# EAGLE design circuit (EAGLE 7.2.0)
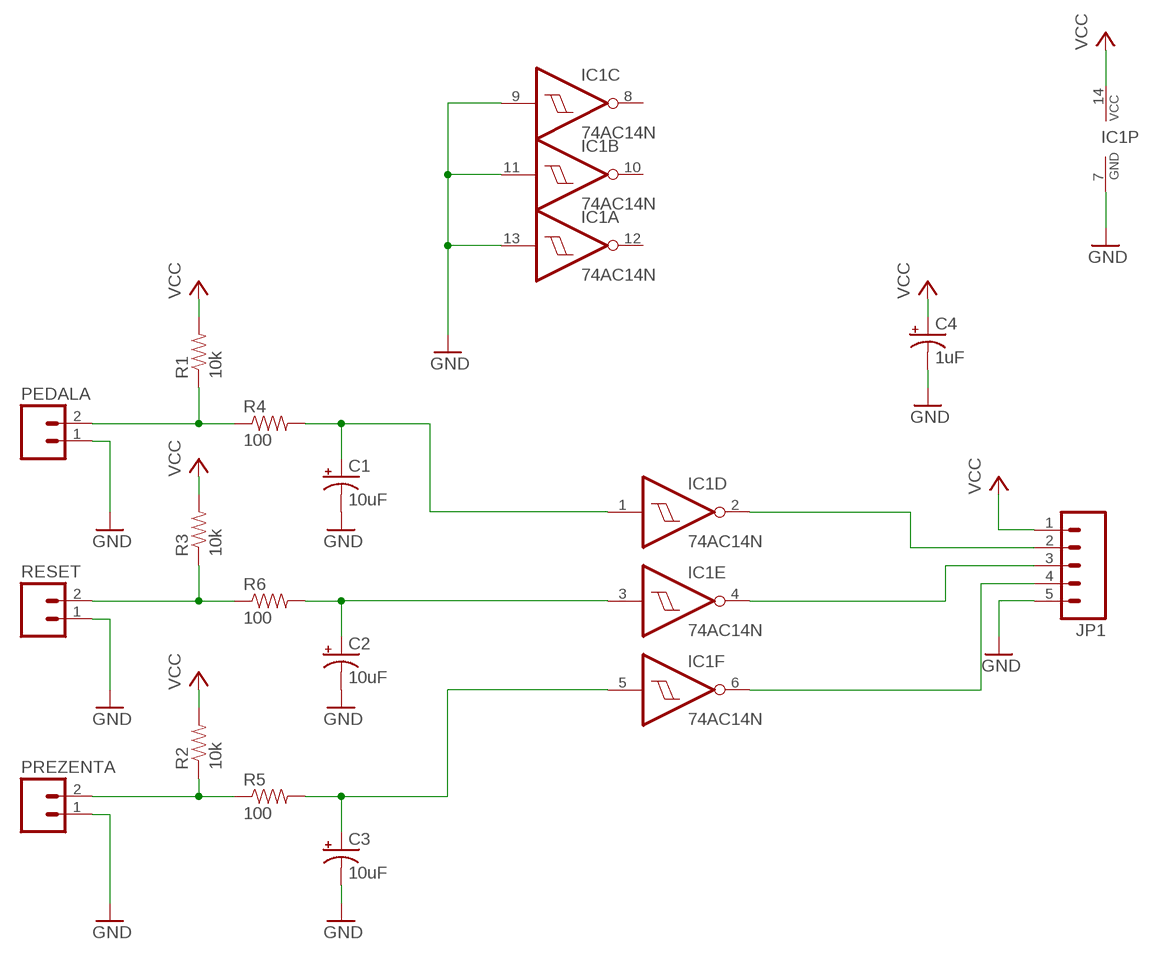
[diagram p0: schematic, sheet 1]

## Parts
C1  10uF  CAP_POLPTH2  [CPOL-RADIAL-10UF-25V]
C2  10uF  CAP_POLPTH2  [CPOL-RADIAL-10UF-25V]
C3  10uF  CAP_POLPTH2  [CPOL-RADIAL-10UF-25V]
C4  1uF  CAP_POLPTH2  [CPOL-RADIAL-10UF-25V]
IC1  74AC14N  [DIL14]
JP1  M05PTH_LONGPADS  [1X05_LONGPADS]
PEDALA  M025MM  [SCREWTERMINAL-5MM-2]
PREZENTA  M025MM  [SCREWTERMINAL-5MM-2]
R1  10k  RESISTORPTH-1/4W  [AXIAL-0.4]
R2  10k  RESISTORPTH-1/4W  [AXIAL-0.4]
R3  10k  RESISTORPTH-1/4W  [AXIAL-0.4]
R4  100  RESISTORPTH-1/4W  [AXIAL-0.4]
R5  100  RESISTORPTH-1/4W  [AXIAL-0.4]
R6  100  RESISTORPTH-1/4W  [AXIAL-0.4]
RESET  M025MM  [SCREWTERMINAL-5MM-2]

## Nets
GND: C1.2(-) C2.2(-) C3.2(-) C4.2(-) IC1.7(P:GND) IC1.9(C:I) IC1.11(B:I) IC1.13(A:I) JP1.5 PEDALA.1 PREZENTA.1 RESET.1
N$1: PEDALA.2 R1.P$1 R4.P$1
N$2: C1.1(+) IC1.1(D:I) R4.P$2
N$3: R3.P$1 R6.P$1 RESET.2
N$4: C2.1(+) IC1.3(E:I) R6.P$2
N$5: PREZENTA.2 R2.P$1 R5.P$1
N$6: C3.1(+) IC1.5(F:I) R5.P$2
N$7: IC1.2(D:O) JP1.2
N$8: IC1.4(E:O) JP1.3
N$9: IC1.6(F:O) JP1.4
VCC: C4.1(+) IC1.14(P:VCC) JP1.1 R1.P$2 R2.P$2 R3.P$2
Unconnected: IC1.8(C:O) IC1.10(B:O) IC1.12(A:O)

## Library data of the parts
C1-C4 = SparkFun-Passives:CAP_POL: Capacitor Polarized These are standard SMD and PTH capacitors. Normally 10uF, 47uF, and 100uF in electrolytic and tantalum varieties. Always verify the external diameter of the through hole cap, it varies with capacity, voltage, and manufacturer. The EIA devices should be standard.
IC1 = 74xx-eu:74*14: Hex schmitt trigger INVERTER
JP1 = SparkFun-Connectors:M05: Header 5 Standard 5-pin 0.1" header. Use with straight break away headers (SKU : PRT-00116), right angle break away headers (PRT-00553), swiss pins (PRT-00743), machine pins (PRT-00117), and female headers (PRT-00115). Molex polarized connector foot print use with SKU : PRT-08230 with associated crimp pins and housings.
PEDALA PREZENTA RESET = SparkFun-Connectors:M02: Standard 2-pin 0.1" header. Use with - straight break away headers ( PRT-00116) - right angle break away headers (PRT-00553) - swiss pins (PRT-00743) - machine pins (PRT-00117) - female headers (PRT-00115) Molex polarized connector foot print use with: PRT-08233 with associated crimp pins and housings. 2.54_SCREWTERM for use with PRT-10571. 3.5mm Screw Terminal footprints for PRT-08084 5mm Screw Terminal footprints for use with PRT-08432; STOREFRONT_ID: PRT-08432
R1-R6 = SparkFun-Resistors:RESISTOR: Resistor Basic schematic elements and footprints for 0603, 1206, and PTH resistors.

## Board
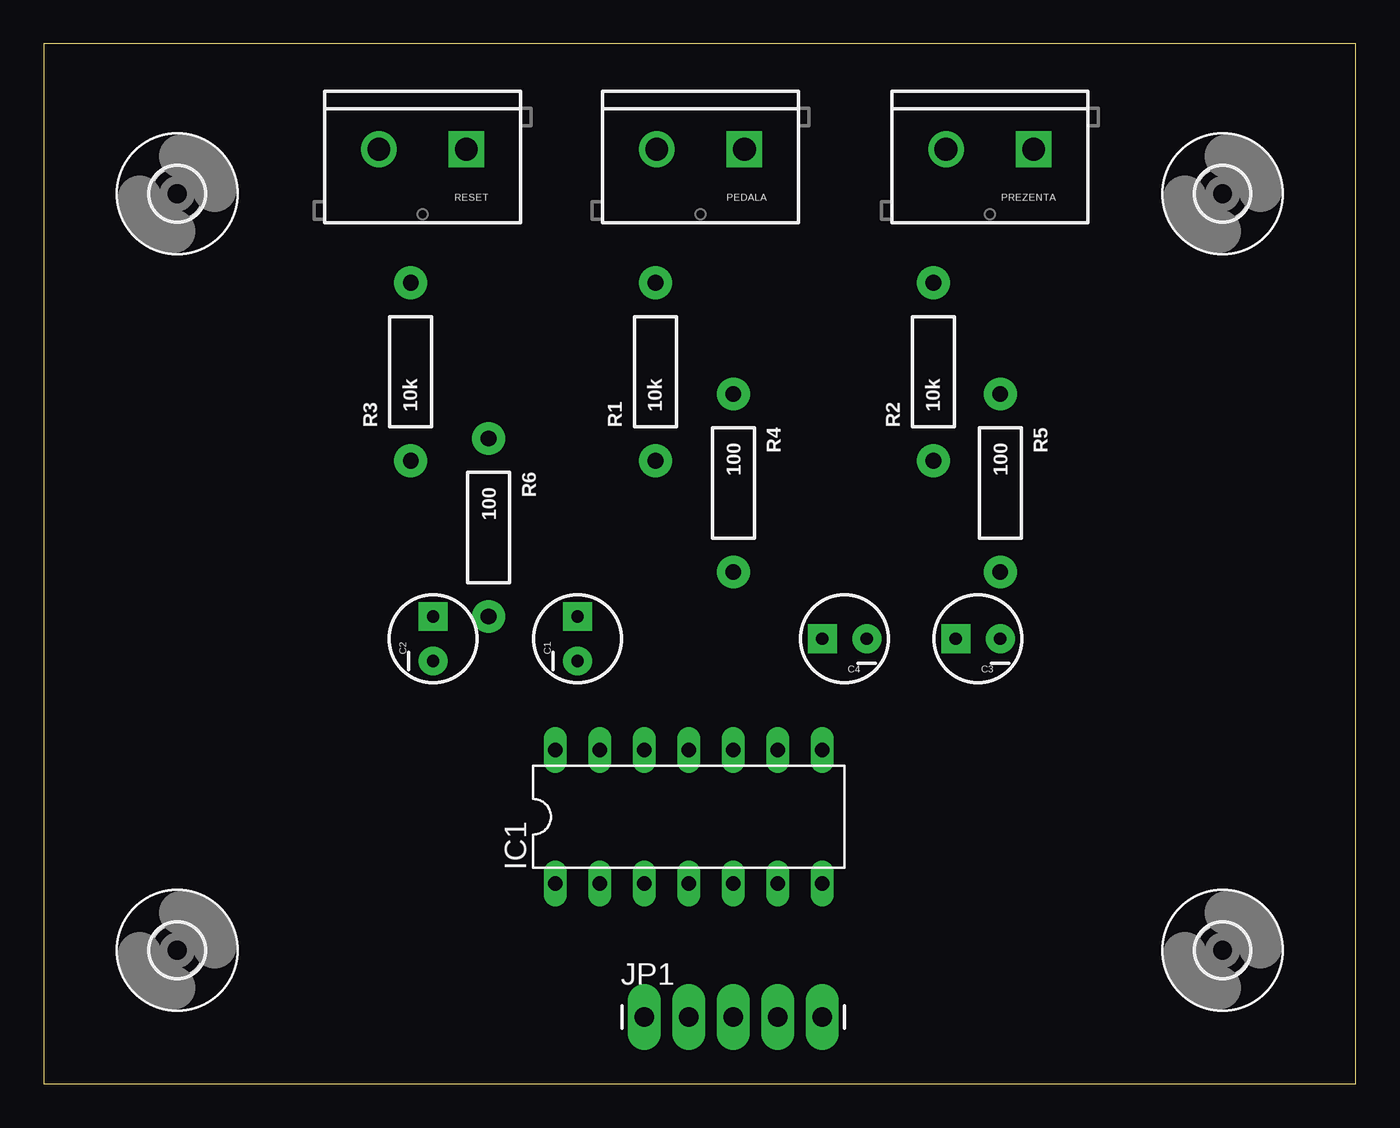
[diagram p1: board, top side]
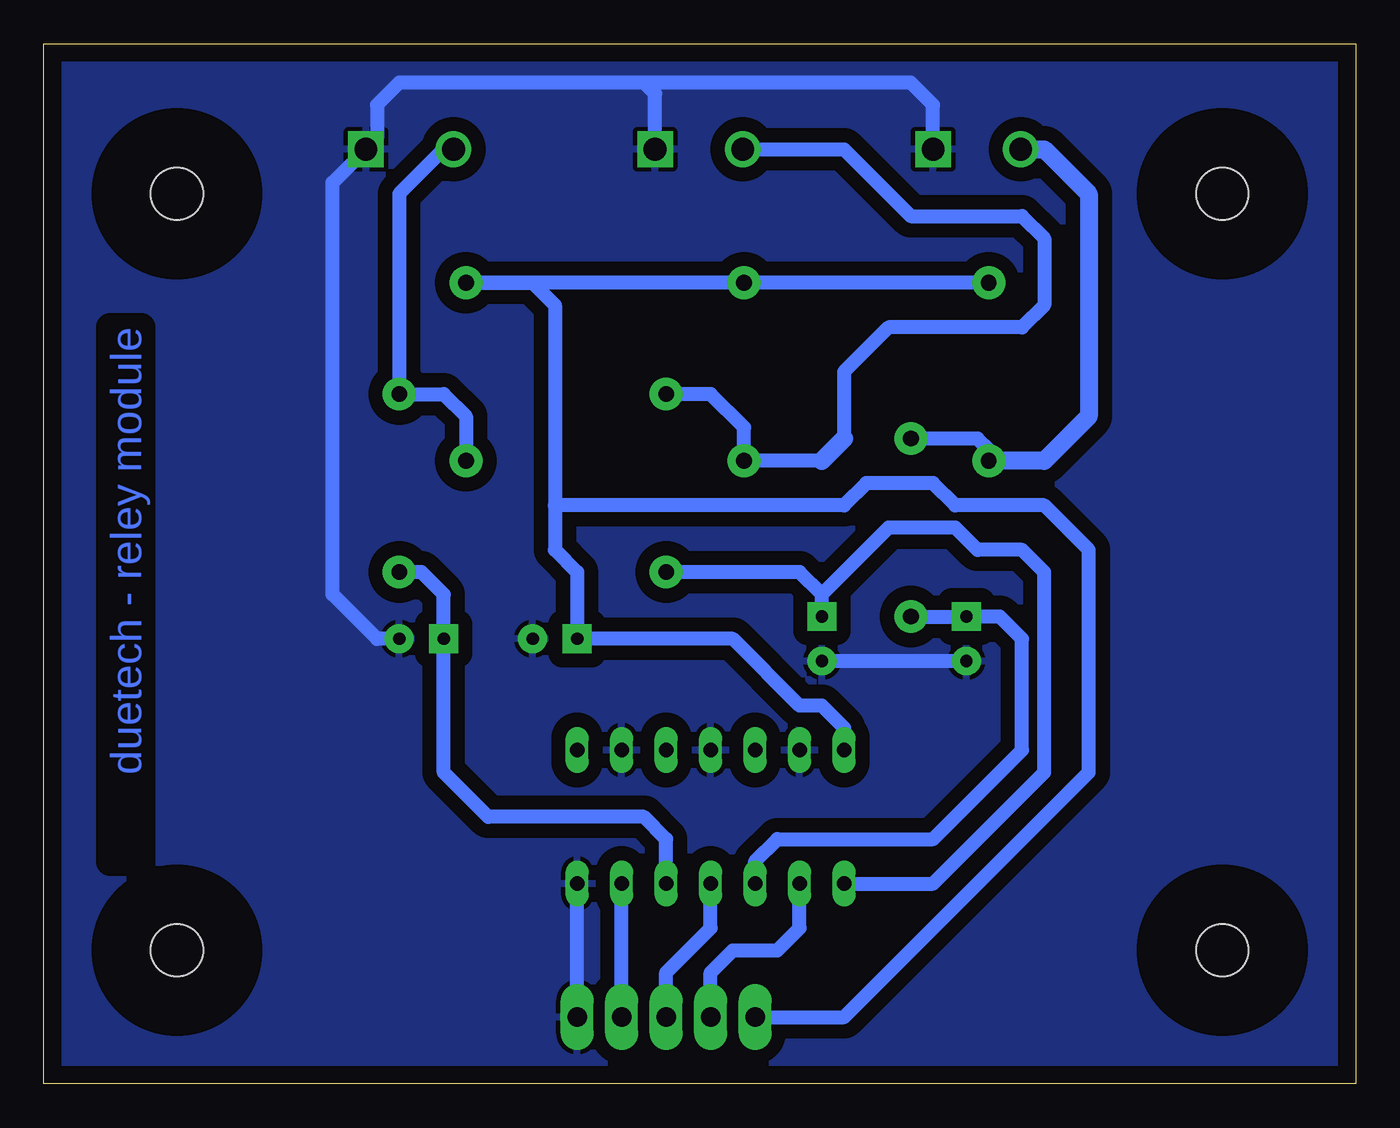
[diagram p2: board, bottom side, seen from below]

Size 74.91 x 59.36 mm. Coordinates in mm from the lower left corner, seen from the top.
Outline: 0,0 74.91,0 74.91,59.36 0,59.36 0,0
Copper layers (1*16): Top 0.035mm / dielectric 1.5mm / Bottom 0.035mm
Design rules "default": minimum track width 10mil, minimum drill 24mil, track to track 8mil, track to pad 8mil, pad to pad 8mil, via to via 8mil, smd to smd 8mil, copper to edge 40mil, drill to drill 8mil, minimum pad ring 10mil, minimum via ring 8mil, stop-mask expansion 4mil, vias tented up to drill 0mil, thermal gap 10mil

### Footprints (pad centres in the part's own frame; a part is rotated, then mirrored left to right if it is on the bottom)
CPOL-RADIAL-10UF-25V = drill 0.7 pad 1.651 square: 1 1.27,0 | drill 0.7 pad 1.651: 2 -1.27,0
DIL14 = drill 0.813 long: 1 -7.62,-3.81; 2 -5.08,-3.81; 3 -2.54,-3.81; 4 0,-3.81; 5 2.54,-3.81; 6 5.08,-3.81; 7 7.62,-3.81; 8 7.62,3.81; 9 5.08,3.81; 10 2.54,3.81; 11 0,3.81; 12 -2.54,3.81; 13 -5.08,3.81; 14 -7.62,3.81
1X05_LONGPADS = drill 1.118 pad 1.88 long: 1 0,0; 2 2.54,0; 3 5.08,0; 4 7.62,0; 5 10.16,0
SCREWTERMINAL-5MM-2 = drill 1.3 pad 2.032 square: 1 0,0 | drill 1.3 pad 2.032: 2 5,0
AXIAL-0.4 = drill 0.9 pad 1.88: P$1 -5.08,0; P$2 5.08,0
3,0 = hole 3: 0,0

### Placement (x,y rotation side)
C1  30.48,25.4 90 top
C2  22.23,25.4 90 top
C3  53.34,25.4 180 top
C4  45.72,25.4 180 top
IC1  36.83,15.24 0 top
JP1  34.29,3.81 0 top
PEDALA  40.01,53.34 180 top
PREZENTA  56.52,53.34 180 top
R1  34.92,40.64 90 top
R2  50.8,40.64 90 top
R3  20.95,40.64 90 top
R4  39.37,34.29 270 top
R5  54.61,34.29 270 top
R6  25.4,31.75 270 top
RESET  24.13,53.34 180 top
U$1  [3,0]  7.62,7.62 0 top
U$2  [3,0]  67.31,7.62 0 top
U$3  [3,0]  67.31,50.8 0 top
U$4  [3,0]  7.62,50.8 0 top

### Tracks (layer width: path | path; a pad name or v marks a point on that pad's centre or on a via)
GND
  Bottom 0.813: C2.2 C1.2 | RESET.1 24.13,55.88 25.4,57.15 40.64,57.15 | 40.64,57.15 54.61,57.15 55.88,55.88 55.88,53.98 PREZENTA.1 58.42,51.44 58.42,27.94 55.88,25.4 C3.2 | PEDALA.1 40.01,56.52 40.64,57.15 | JP1.5 IC1.7
  pour Bottom (isolate 0.813): 0,0 0,59.69 74.93,59.69 74.93,0
N$1
  Bottom 0.813: PEDALA.2 29.21,53.34 25.4,49.53 19.05,49.53 17.78,48.26 17.78,44.45 19.05,43.18 26.67,43.18 29.21,40.64 29.21,36.83 | 30.48,35.56 R1.P$1 34.92,37.47 36.83,39.37 R4.P$1
  Bottom 1.016: 29.21,36.83 30.48,35.56
N$2
  Bottom 0.813: C1.1 30.48,27.94 | 30.48,27.94 31.75,29.21 R4.P$2 | 30.48,27.94 26.67,31.75 22.86,31.75 21.59,30.48 19.05,30.48 17.78,29.21 17.78,17.78 24.13,11.43 IC1.1
N$3
  Bottom 0.813: R3.P$1 20.95,36.2 21.59,36.83 R6.P$1
  Bottom 1.016: RESET.2 17.78,53.34 15.24,50.8 15.24,38.1 17.78,35.56 R3.P$1
N$4
  Bottom 0.813: R6.P$2 C2.1 20.32,26.67 19.05,25.4 19.05,19.05 24.13,13.97 33.02,13.97 34.29,12.7 IC1.3
N$5
  Bottom 0.813: R2.P$1 50.8,38.1 52.07,39.37 R5.P$1 54.61,50.8 52.07,53.34 PREZENTA.2
N$6
  Bottom 0.813: R5.P$2 53.34,29.21 52.07,27.94 C3.1 52.07,17.78 49.53,15.24 40.64,15.24 39.37,13.97 IC1.5
N$7
  Bottom 0.813: JP1.2 36.83,6.35 35.56,7.62 33.02,7.62 31.75,8.89 IC1.2
N$8
  Bottom 0.813: JP1.3 39.37,6.35 36.83,8.89 IC1.4
N$9
  Bottom 0.813: JP1.4 IC1.6
VCC
  Bottom 0.813: R3.P$2 R1.P$2 R2.P$2 46.99,45.72 45.72,44.45 45.72,33.02 | 45.72,33.02 45.72,30.48 44.45,29.21 C4.1 35.56,25.4 31.75,21.59 30.48,21.59 29.21,20.32 IC1.14 | JP1.1 29.21,3.81 15.24,17.78 15.24,30.48 17.78,33.02 22.86,33.02 24.13,34.29 27.94,34.29 29.21,33.02 45.72,33.02

### Text on the board
Bottom: duetech - reley module